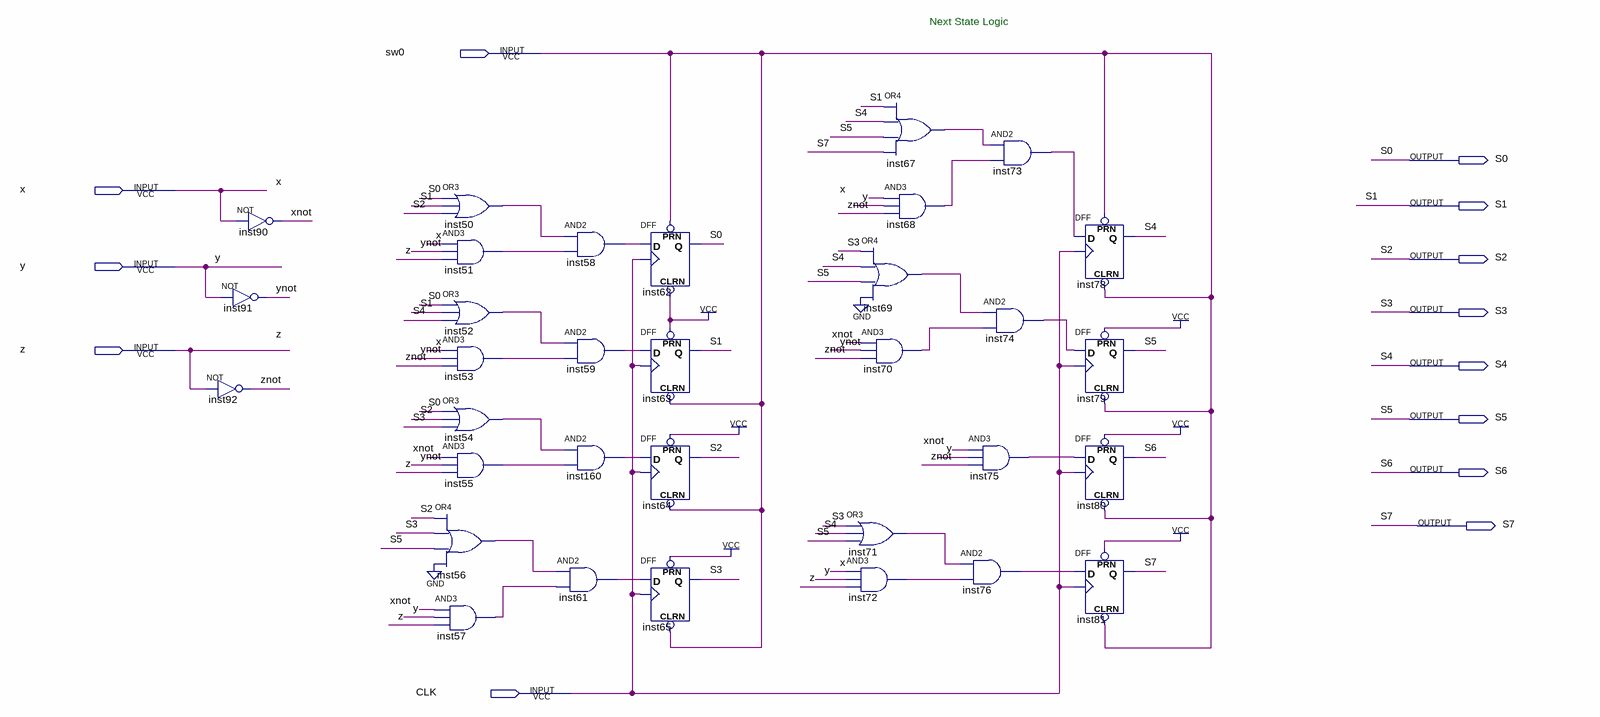
[diagram p0: schematic sheet]
// Quartus schematic next_state_logic.bdf as structural Verilog: 33 symbols, 13 pins
module next_state_logic (
  input  sw0,
  input  x,
  input  y,
  input  z,
  input  CLK,
  output S0,
  output S1,
  output S2,
  output S3,
  output S4,
  output S5,
  output S6,
  output S7
);

  wire inst50_out, inst51_out, inst52_out, inst53_out, inst54_out, inst55_out, inst56_out, inst57_out,
       inst58_out, inst59_out, inst61_out, inst67_out, inst68_out, inst69_out, inst70_out, inst71_out,
       inst72_out, inst73_out, inst74_out, inst75_out, inst76_out, inst160_out, xnot, ynot, znot;

  not inst91 (ynot, y);
  not inst92 (znot, z);
  not inst90 (xnot, x);
  or inst50 (inst50_out, S0, S1, S2);
  and inst51 (inst51_out, x, ynot, z);
  or inst52 (inst52_out, S0, S1, S4);
  and inst53 (inst53_out, x, ynot, znot);
  or inst54 (inst54_out, S0, S2, S3);
  and inst55 (inst55_out, xnot, ynot, z);
  or inst56 (inst56_out, S2, S3, S5, 1'b0);
  and inst57 (inst57_out, xnot, y, z);
  and inst58 (inst58_out, inst50_out, inst51_out);
  and inst59 (inst59_out, inst52_out, inst53_out);
  and inst160 (inst160_out, inst54_out, inst55_out);
  and inst61 (inst61_out, inst56_out, inst57_out);
  DFF inst62 (.CLRN(1'b1), .CLK(CLK), .D(inst58_out), .PRN(sw0), .Q(S0));
  DFF inst63 (.CLRN(sw0), .CLK(CLK), .D(inst59_out), .PRN(1'b1), .Q(S1));
  DFF inst64 (.CLRN(sw0), .CLK(CLK), .D(inst160_out), .PRN(1'b1), .Q(S2));
  DFF inst65 (.CLRN(sw0), .CLK(CLK), .D(inst61_out), .PRN(1'b1), .Q(S3));
  or inst67 (inst67_out, S1, S4, S5, S7);
  and inst68 (inst68_out, x, y, znot);
  or inst69 (inst69_out, S3, S4, S5, 1'b0);
  and inst70 (inst70_out, xnot, ynot, znot);
  or inst71 (inst71_out, S3, S4, S5);
  and inst72 (inst72_out, x, y, z);
  and inst73 (inst73_out, inst67_out, inst68_out);
  and inst74 (inst74_out, inst69_out, inst70_out);
  and inst75 (inst75_out, xnot, y, znot);
  and inst76 (inst76_out, inst71_out, inst72_out);
  DFF inst78 (.CLRN(sw0), .CLK(CLK), .D(inst73_out), .PRN(sw0), .Q(S4));
  DFF inst79 (.CLRN(sw0), .CLK(CLK), .D(inst74_out), .PRN(1'b1), .Q(S5));
  DFF inst80 (.CLRN(sw0), .CLK(CLK), .D(inst75_out), .PRN(1'b1), .Q(S6));
  DFF inst81 (.CLRN(sw0), .CLK(CLK), .D(inst76_out), .PRN(1'b1), .Q(S7));

  // Notes on the sheet:
  //   Next State Logic
endmodule
